# Altium schematic sheet 2.processor.SchDoc
size A3; Organization: Altium Limited; Address1: L3, 12a Rodborough Rd; Address2: Frenchs Forest; Address3: NSW; Address4: Australia 2086; SheetNumber: 2; SheetTotal: 4
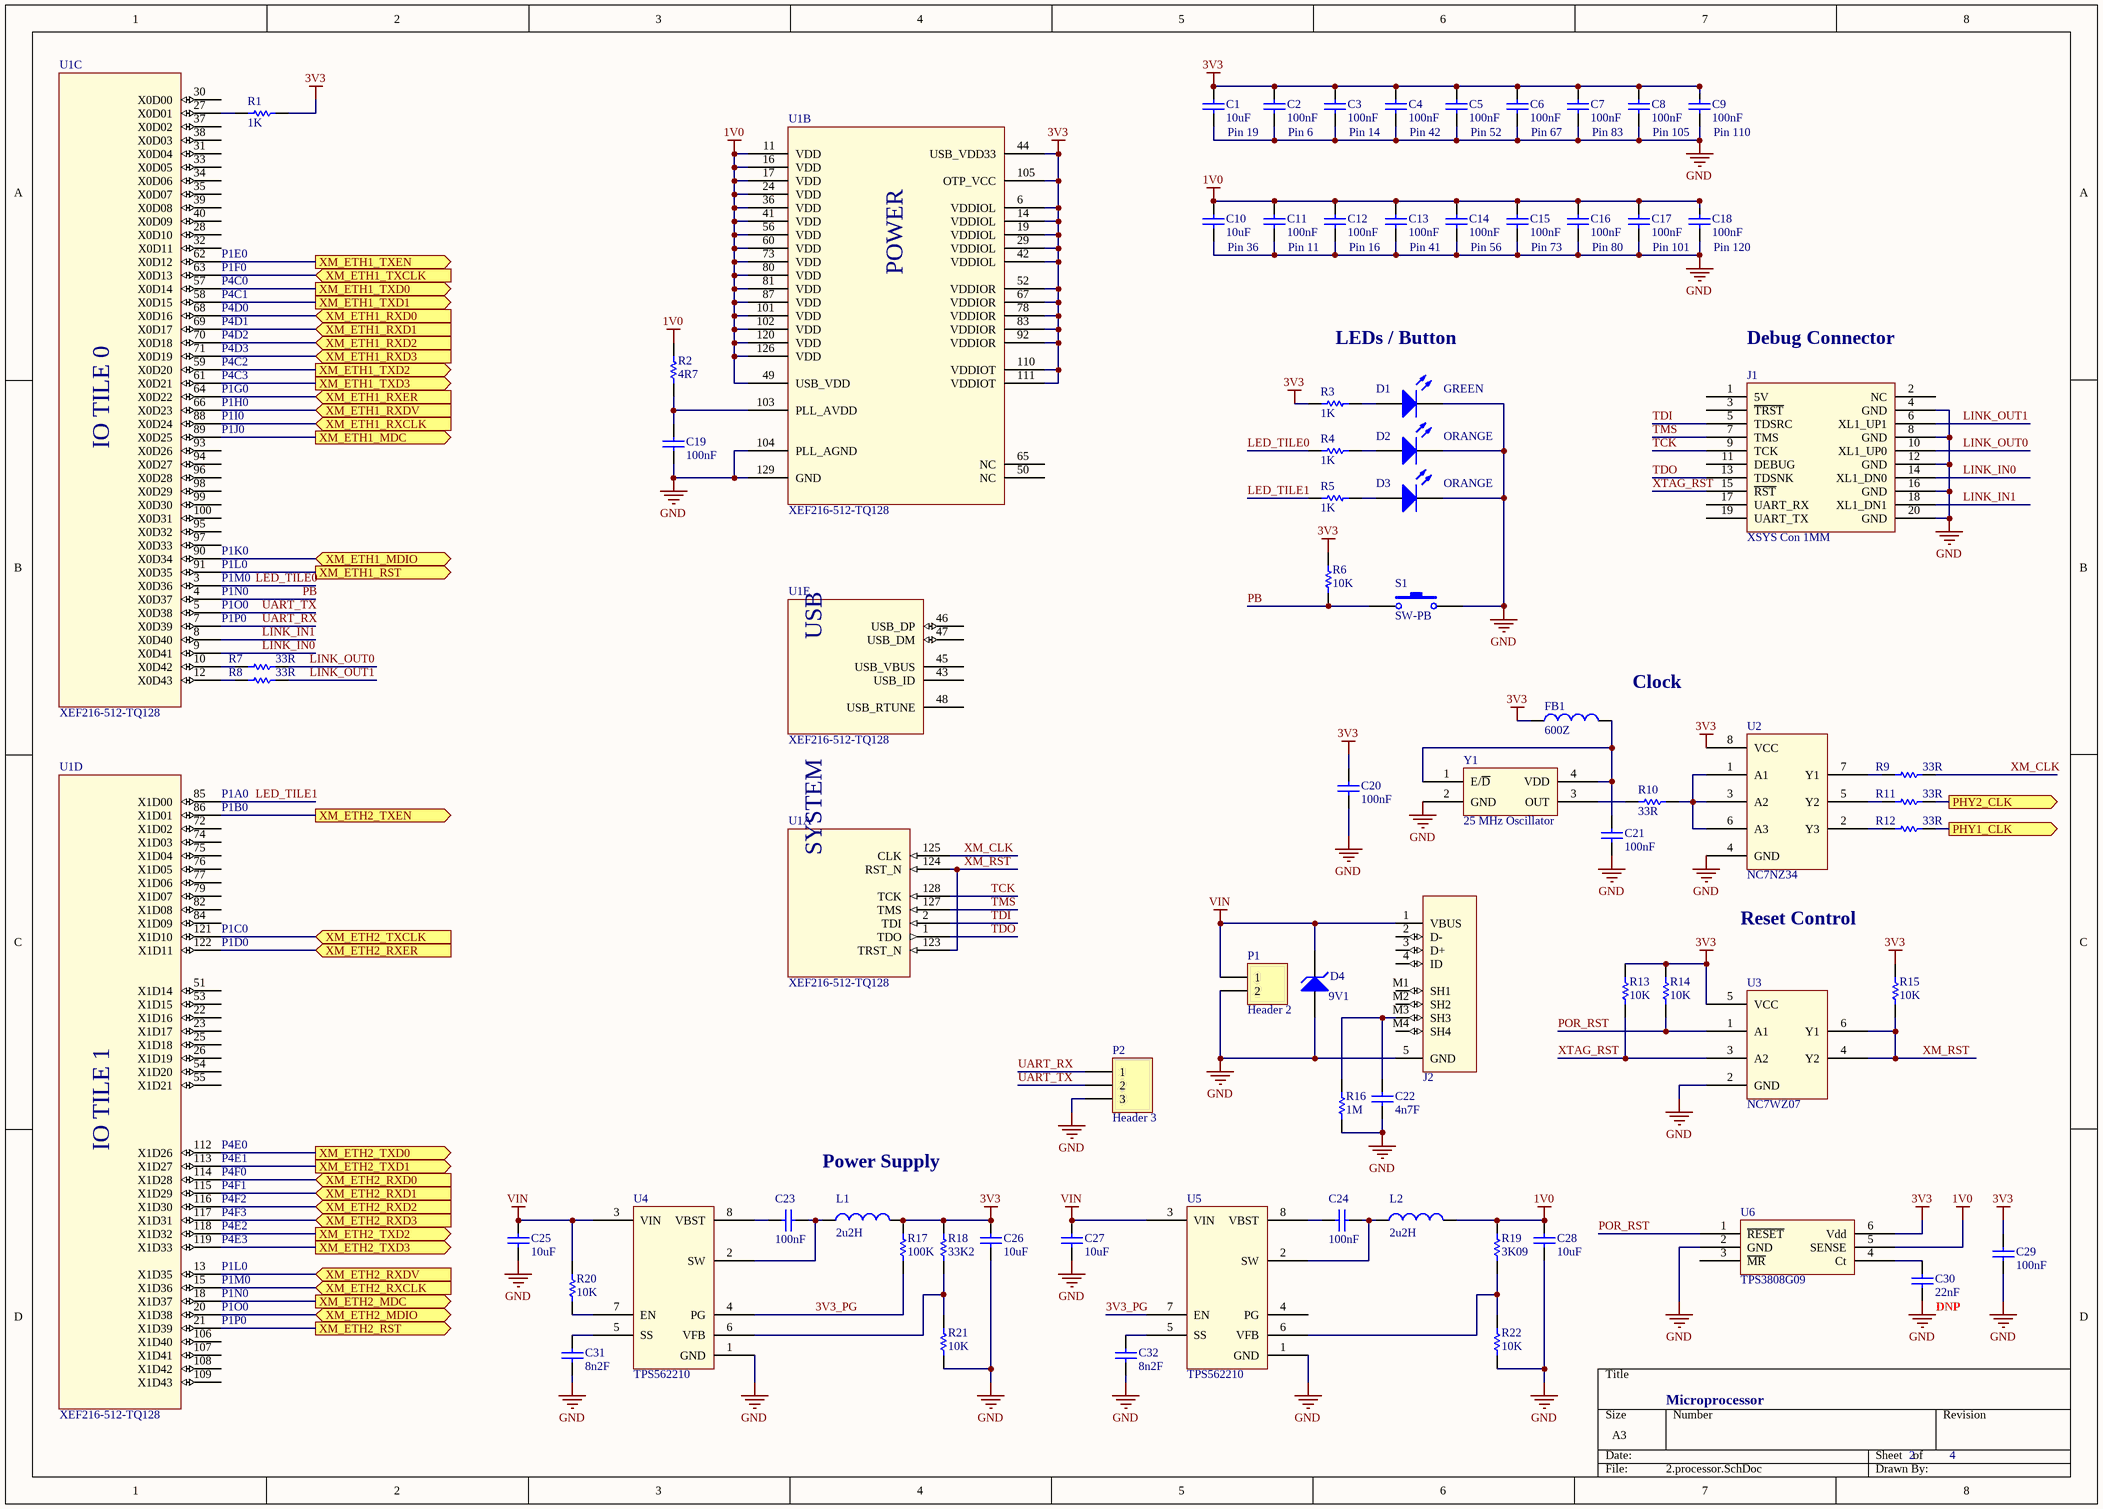
[diagram p0: 2.processor.SchDoc]

## Parts
C1  Pin 19  value 10uF  [1608[0603]_CAP2]
C2  Pin 6  value 100nF  [1005[0402]_CAP2]
C3  Pin 14  value 100nF  [1005[0402]_CAP2]
C4  Pin 42  value 100nF  [1005[0402]_CAP2]
C5  Pin 52  value 100nF  [1005[0402]_CAP2]
C6  Pin 67  value 100nF  [1005[0402]_CAP2]
C7  Pin 83  value 100nF  [1005[0402]_CAP2]
C8  Pin 105  value 100nF  [1005[0402]_CAP2]
C9  Pin 110  value 100nF  [1005[0402]_CAP2]
C10  Pin 36  value 10uF  [1608[0603]_CAP2]
C11  Pin 11  value 100nF  [1005[0402]_CAP2]
C12  Pin 16  value 100nF  [1005[0402]_CAP2]
C13  Pin 41  value 100nF  [1005[0402]_CAP2]
C14  Pin 56  value 100nF  [1005[0402]_CAP2]
C15  Pin 73  value 100nF  [1005[0402]_CAP2]
C16  Pin 80  value 100nF  [1005[0402]_CAP2]
C17  Pin 101  value 100nF  [1005[0402]_CAP2]
C18  Pin 120  value 100nF  [1005[0402]_CAP2]
C19  value 100nF  [1005[0402]_CAP2]  (hidden comment: Cap)
C20  value 100nF  [1005[0402]_CAP2]  (hidden comment: Cap)
C21  value 100nF  [1005[0402]_CAP2]  (hidden comment: Cap)
C22  value 4n7F  [1005[0402]_CAP2]  (hidden comment: Cap)
C23  value 100nF  [1005[0402]_CAP2]  (hidden comment: Cap)
C24  value 100nF  [1005[0402]_CAP2]  (hidden comment: Cap)
C25  value 10uF  [1608[0603]_CAP2]  (hidden comment: Cap)
C26  value 10uF  [1608[0603]_CAP2]  (hidden comment: Cap)
C27  value 10uF  [1608[0603]_CAP2]  (hidden comment: Cap)
C28  value 10uF  [1608[0603]_CAP2]  (hidden comment: Cap)
C29  value 100nF  [1005[0402]_CAP2]  (hidden comment: Cap)
C30  value 22nF  [1005[0402]_CAP2]  (hidden comment: Cap)
C31  value 8n2F  [1005[0402]_CAP2]  (hidden comment: Cap)
C32  value 8n2F  [1005[0402]_CAP2]  (hidden comment: Cap)
D1  value GREEN  [1608[0603]_LED]  (hidden comment: LED3)
D2  value ORANGE  [1608[0603]_LED]  (hidden comment: LED3)
D3  value ORANGE  [1608[0603]_LED]  (hidden comment: LED3)
D4  value 9V1  [SOD123F]  (hidden comment: Zener Diode)
FB1  value 600Z  [1005[0402]_FB2]  (hidden comment: Ferrite Bead)
J1  XSYS Con 1MM  [M40-3201045R]
J2  Micro-USB B Receptacle  [MOLEX_105017-0001]  (value not drawn)
L1  value 2u2H  [2012[0805]_IND]  (hidden comment: Inductor)
L2  value 2u2H  [2012[0805]_IND]  (hidden comment: Inductor)
P1  Header 2  [HDR1X2]
P2  Header 3  [HDR1X3]
R1  value 1K  [1005[0402]_RES2]  (hidden comment: Res)
R2  value 4R7  [1005[0402]_RES2]  (hidden comment: Res)
R3  value 1K  [1005[0402]_RES2]  (hidden comment: Res)
R4  value 1K  [1005[0402]_RES2]  (hidden comment: Res)
R5  value 1K  [1005[0402]_RES2]  (hidden comment: Res)
R6  value 10K  [1005[0402]_RES2]  (hidden comment: Res)
R7  value 33R  [1005[0402]_RES2]  (hidden comment: Res)
R8  value 33R  [1005[0402]_RES2]  (hidden comment: Res)
R9  value 33R  [1005[0402]_RES2]  (hidden comment: Res)
R10  value 33R  [1005[0402]_RES2]  (hidden comment: Res)
R11  value 33R  [1005[0402]_RES2]  (hidden comment: Res)
R12  value 33R  [1005[0402]_RES2]  (hidden comment: Res)
R13  value 10K  [1005[0402]_RES2]  (hidden comment: Res)
R14  value 10K  [1005[0402]_RES2]  (hidden comment: Res)
R15  value 10K  [1005[0402]_RES2]  (hidden comment: Res)
R16  value 1M  [1005[0402]_RES2]  (hidden comment: Res)
R17  value 100K  [1005[0402]_RES2]  (hidden comment: Res)
R18  value 33K2  [1005[0402]_RES2]  (hidden comment: Res)
R19  value 3K09  [1005[0402]_RES2]  (hidden comment: Res)
R20  value 10K  [1005[0402]_RES2]  (hidden comment: Res)
R21  value 10K  [1005[0402]_RES2]  (hidden comment: Res)
R22  value 10K  [1005[0402]_RES2]  (hidden comment: Res)
S1  SW-PB  [TACTILE_SW_6035_1]
U1  XEF216-512-TQ128  [XMOS_LQFP_128_XEF216_512]  (parts A,B,C,D,E of 5)
U2  NC7NZ34  [US8]
U3  NC7WZ07  [SOT363-6M_SC70]
U4  TPS562210  [SOT-23-8]
U5  TPS562210  [SOT-23-8]
U6  TPS3808G09  [SOT23-6]
Y1  25 MHz Oscillator  [OSC_32_25]

## Ports
PHY1_CLK (out), PHY2_CLK (out), XM_ETH1_MDC (out), XM_ETH1_MDIO (bidir), XM_ETH1_RST (out), XM_ETH1_RXCLK (in), XM_ETH1_RXD0 (in), XM_ETH1_RXD1 (in), XM_ETH1_RXD2 (in), XM_ETH1_RXD3 (in), XM_ETH1_RXDV (in), XM_ETH1_RXER (in), XM_ETH1_TXCLK (in), XM_ETH1_TXD0 (out), XM_ETH1_TXD1 (out), XM_ETH1_TXD2 (out), XM_ETH1_TXD3 (out), XM_ETH1_TXEN (out), XM_ETH2_MDC (out), XM_ETH2_MDIO (bidir), XM_ETH2_RST (out), XM_ETH2_RXCLK (in), XM_ETH2_RXD0 (in), XM_ETH2_RXD1 (in), XM_ETH2_RXD2 (in), XM_ETH2_RXD3 (in), XM_ETH2_RXDV (in), XM_ETH2_RXER (in), XM_ETH2_TXCLK (in), XM_ETH2_TXD0 (out), XM_ETH2_TXD1 (out), XM_ETH2_TXD2 (out), XM_ETH2_TXD3 (out), XM_ETH2_TXEN (out)

## Nets
1V0: C10.2 C11.2 C12.2 C13.2 C14.2 C15.2 C16.2 C17.2 C18.2 C28.2 L2.2 R2.2 R19.2 U1.11(VDD) U1.16(VDD) U1.17(VDD) U1.24(VDD) U1.36(VDD) U1.41(VDD) U1.49(USB_VDD) U1.56(VDD) U1.60(VDD) U1.73(VDD) U1.80(VDD) U1.81(VDD) U1.87(VDD) U1.101(VDD) U1.102(VDD) U1.120(VDD) U1.126(VDD) U6.5(SENSE)
3V3: C1.2 C2.2 C3.2 C4.2 C5.2 C6.2 C7.2 C8.2 C9.2 C20.2 C26.2 C29.2 FB1.1 L1.2 R1.2 R3.2 R6.2 R13.2 R14.2 R15.2 R17.2 R18.2 U1.6(VDDIOL) U1.14(VDDIOL) U1.19(VDDIOL) U1.29(VDDIOL) U1.42(VDDIOL) U1.44(USB_VDD33) U1.52(VDDIOR) U1.67(VDDIOR) U1.78(VDDIOR) U1.83(VDDIOR) U1.92(VDDIOR) U1.105(OTP_VCC) U1.110(VDDIOT) U1.111(VDDIOT) U2.8(VCC) U3.5(VCC) U6.6(Vdd)
GND: C1.1 C2.1 C3.1 C4.1 C5.1 C6.1 C7.1 C8.1 C9.1 C10.1 C11.1 C12.1 C13.1 C14.1 C15.1 C16.1 C17.1 C18.1 C19.1 C20.1 C21.1 C22.1 C25.1 C26.1 C27.1 C28.1 C29.1 C30.1 C31.1 C32.1 D1.2(K) D2.2(K) D3.2(K) D4.1(A) J1.4(GND) J1.8(GND) J1.12(GND) J1.16(GND) J1.20(GND) J2.5(GND) P1.2 P2.3 R16.1 R21.1 R22.1 S1.2 U1.104(PLL_AGND) U1.129(GND) U2.4(GND) U3.2(GND) U4.1(GND) U5.1(GND) U6.2(GND) Y1.2(GND)
VIN: C25.2 C27.2 D4.2(K) J2.1(VBUS) P1.1 R20.2 U4.3(VIN) U5.3(VIN)
3V3_PG: R17.1 U4.4(PG) U5.7(EN)
LED_TILE0: R4.2 U1.3(X0D36)
LED_TILE1: R5.2 U1.85(X1D00)
LINK_IN0: J1.14(XL1_DN0) U1.9(X0D41)
LINK_IN1: J1.18(XL1_DN1) U1.8(X0D40)
LINK_OUT0: J1.10(XL1_UP0) R7.1
LINK_OUT1: J1.6(XL1_UP1) R8.1
PB: R6.1 S1.1 U1.4(X0D37)
PHY1_CLK: R12.1 ; port PHY1_CLK
PHY2_CLK: R11.1 ; port PHY2_CLK
POR_RST: R14.1 U3.1(A1) U6.1(~{RESET})
TCK: J1.9(TCK) U1.128(TCK)
TDI: J1.5(TDSRC) U1.2(TDI)
TDO: J1.13(TDSNK) U1.1(TDO)
TMS: J1.7(TMS) U1.127(TMS)
UART_RX: P2.1 U1.7(X0D39)
UART_TX: P2.2 U1.5(X0D38)
XM_CLK: R9.1 U1.125(CLK)
XM_ETH1_MDC: U1.89(X0D25) ; port XM_ETH1_MDC
XM_ETH1_MDIO: U1.90(X0D34) ; port XM_ETH1_MDIO
XM_ETH1_RST: U1.91(X0D35) ; port XM_ETH1_RST
XM_ETH1_RXCLK: U1.88(X0D24) ; port XM_ETH1_RXCLK
XM_ETH1_RXD0: U1.68(X0D16) ; port XM_ETH1_RXD0
XM_ETH1_RXD1: U1.69(X0D17) ; port XM_ETH1_RXD1
XM_ETH1_RXD2: U1.70(X0D18) ; port XM_ETH1_RXD2
XM_ETH1_RXD3: U1.71(X0D19) ; port XM_ETH1_RXD3
XM_ETH1_RXDV: U1.66(X0D23) ; port XM_ETH1_RXDV
XM_ETH1_RXER: U1.64(X0D22) ; port XM_ETH1_RXER
XM_ETH1_TXCLK: U1.63(X0D13) ; port XM_ETH1_TXCLK
XM_ETH1_TXD0: U1.57(X0D14) ; port XM_ETH1_TXD0
XM_ETH1_TXD1: U1.58(X0D15) ; port XM_ETH1_TXD1
XM_ETH1_TXD2: U1.59(X0D20) ; port XM_ETH1_TXD2
XM_ETH1_TXD3: U1.61(X0D21) ; port XM_ETH1_TXD3
XM_ETH1_TXEN: U1.62(X0D12) ; port XM_ETH1_TXEN
XM_ETH2_MDC: U1.18(X1D37) ; port XM_ETH2_MDC
XM_ETH2_MDIO: U1.20(X1D38) ; port XM_ETH2_MDIO
XM_ETH2_RST: U1.21(X1D39) ; port XM_ETH2_RST
XM_ETH2_RXCLK: U1.15(X1D36) ; port XM_ETH2_RXCLK
XM_ETH2_RXD0: U1.114(X1D28) ; port XM_ETH2_RXD0
XM_ETH2_RXD1: U1.115(X1D29) ; port XM_ETH2_RXD1
XM_ETH2_RXD2: U1.116(X1D30) ; port XM_ETH2_RXD2
XM_ETH2_RXD3: U1.117(X1D31) ; port XM_ETH2_RXD3
XM_ETH2_RXDV: U1.13(X1D35) ; port XM_ETH2_RXDV
XM_ETH2_RXER: U1.122(X1D11) ; port XM_ETH2_RXER
XM_ETH2_TXCLK: U1.121(X1D10) ; port XM_ETH2_TXCLK
XM_ETH2_TXD0: U1.112(X1D26) ; port XM_ETH2_TXD0
XM_ETH2_TXD1: U1.113(X1D27) ; port XM_ETH2_TXD1
XM_ETH2_TXD2: U1.118(X1D32) ; port XM_ETH2_TXD2
XM_ETH2_TXD3: U1.119(X1D33) ; port XM_ETH2_TXD3
XM_ETH2_TXEN: U1.86(X1D01) ; port XM_ETH2_TXEN
XM_RST: R15.1 U1.123(TRST_N) U1.124(RST_N) U3.4(Y2) U3.6(Y1)
XTAG_RST: J1.15(~{RST}) R13.1 U3.3(A2)
NetC19_2: C19.2 R2.1 U1.103(PLL_AVDD)
NetC21_2: C21.2 FB1.2 Y1.1(E/~{D}) Y1.4(VDD)
NetC22_2: C22.2 J2.M3(SH3) R16.2
NetC23_1: C23.1 U4.8(VBST)
NetC23_2: C23.2 L1.1 U4.2(SW)
NetC24_1: C24.1 U5.8(VBST)
NetC24_2: C24.2 L2.1 U5.2(SW)
NetC30_2: C30.2 U6.4(Ct)
NetC31_2: C31.2 U4.5(SS)
NetC32_2: C32.2 U5.5(SS)
NetD1_1: D1.1(A) R3.1
NetD2_1: D2.1(A) R4.1
NetD3_1: D3.1(A) R5.1
NetR1_1: R1.1 U1.27(X0D01)
NetR7_2: R7.2 U1.10(X0D42)
NetR8_2: R8.2 U1.12(X0D43)
NetR9_2: R9.2 U2.7(Y1)
NetR10_1: R10.1 U2.1(A1) U2.3(A2) U2.6(A3)
NetR10_2: R10.2 Y1.3(OUT)
NetR11_2: R11.2 U2.5(Y2)
NetR12_2: R12.2 U2.2(Y3)
NetR18_1: R18.1 R21.2 U4.6(VFB)
NetR19_1: R19.1 R22.2 U5.6(VFB)
NetR20_1: R20.1 U4.7(EN)

Not connected (* = marked no-connect by the designer): J1 1(5V) 2(NC) 3(~{TRST}) 11(DEBUG) 17(UART_RX) 19(UART_TX); J2 2(D-) 3(D+) 4(ID) M1(SH1) M2(SH2) M4(SH4); U1 22(X1D16) 23(X1D17) 25(X1D18) 26(X1D19) 28(X0D10) 30(X0D00) 31(X0D04) 32(X0D11) 33(X0D05) 34(X0D06) 35(X0D07) 37(X0D02) 38(X0D03) 39(X0D08) 40(X0D09) 43(USB_ID) 45(USB_VBUS) 46(USB_DP) 47(USB_DM) 48(USB_RTUNE) 50(NC) 51(X1D14) 53(X1D15) 54(X1D20) 55(X1D21) 65(NC) 72(X1D02) 74(X1D03) 75(X1D04) 76(X1D05) 77(X1D06) 79(X1D07) 82(X1D08) 84(X1D09) 93(X0D26) 94(X0D27) 95(X0D32) 96(X0D28) 97(X0D33) 98(X0D29) 99(X0D30) 100(X0D31) 106(X1D40) 107(X1D41) 108(X1D42) 109(X1D43); U5 4(PG); U6 3(~{MR})

## Notes on the sheet
- (near U1) P1E0
- (near U1) P1F0
- (near U1) P4C0
- (near U1) P4C1
- (near U1) P4D0
- (near U1) P4D1
- (near U1) P4D2
- (near U1) P4D3
- (near U1) P4C2
- (near U1) P4C3
- LEDs / Button
- (near J1) Debug Connector
- (near U1) P1G0
- (near U1) P1H0
- (near U1) P1I0
- (near U1) P1J0
- (near U1) P1K0
- (near U1) P1L0
- (near U1) P1M0
- (near U1) P1N0
- P1O0
- P1P0
- (near FB1) Clock
- (near U1) P1A0
- (near U1) P1B0
- (near U1) P1C0
- (near U1) P1D0
- Reset Control
- (near U1) P4E0
- (near U1) P4E1
- (near U1) P4F0
- (near U1) P4F1
- Power Supply
- (near U1) P4F2
- (near U1) P4F3
- (near U1) P4E2
- (near U1) P4E3
- (near U1) P1O0
- (near U1) P1P0
- (near C30) DNP
- Microprocessor
- Title
- Size:
- Date:
- A3
- Number:
- Time:
- Revision:
- Sheet
- of
- File:
- (in symbol XEF216-512-TQ128, part A) SYSTEM
- (in symbol XEF216-512-TQ128, part B) POWER
- (in symbol XEF216-512-TQ128, part C) IO TILE 0
- (in symbol XEF216-512-TQ128, part D) IO TILE 1
- (in symbol XEF216-512-TQ128, part E) USB

## Library data of the parts
C1 C10 C25-C28 = Cap: Capacitor; Manufacturer: SAMSUNG; Vendor: Digikey; VendorCode: 1276-6775-1-ND; ProductCode: CL10A106MPNNHBC; Published: 8-Jun-2000; LatestRevisionDate: 17-Jul-2002; LatestRevisionNote: Re-released for DXP Platform.; PackageReference: RAD-0.3; Publisher: Altium Limited; Price: 0,22
C2-C9 C11-C21 C23 C24 C29 = Cap: Capacitor; Manufacturer: SAMSUNG; ProductCode: CL05B104KO5NNNC; Vendor: Digikey; VendorCode: 1276-1001-1-ND; Published: 8-Jun-2000; LatestRevisionDate: 17-Jul-2002; LatestRevisionNote: Re-released for DXP Platform.; PackageReference: RAD-0.3; Publisher: Altium Limited; Price: 0,01
C22 = Cap: Capacitor; Manufacturer: SAMSUNG; Vendor: Digikey; ProductCode: CL05B472KB5NNNC; VendorCode: 1276-1125-1-ND; Published: 8-Jun-2000; LatestRevisionDate: 17-Jul-2002; LatestRevisionNote: Re-released for DXP Platform.; PackageReference: RAD-0.3; Publisher: Altium Limited; Price: 0,09
C30 = Cap: Capacitor; Manufacturer: SAMSUNG; ProductCode: CL05B223KP5NNNC; Vendor: Digikey; VendorCode: 1276-1538-1-ND; Published: 8-Jun-2000; LatestRevisionDate: 17-Jul-2002; LatestRevisionNote: Re-released for DXP Platform.; PackageReference: RAD-0.3; Publisher: Altium Limited; Price: 0,10
C31 C32 = Cap: Capacitor; Manufacturer: SAMSUNG; ProductCode: CL05B822KA5NNNC; VendorCode: 1276-1590-1-ND; Vendor: Digikey; Published: 8-Jun-2000; LatestRevisionDate: 17-Jul-2002; LatestRevisionNote: Re-released for DXP Platform.; PackageReference: RAD-0.3; Publisher: Altium Limited; Price: 0,09
D1 = LED3: SMD LED; Manufacturer: BROADCOM; ProductCode: HSMG-C190; Vendor: Digikey; VendorCode: 516-1425-1-ND; Published: 8-Jun-2000; LatestRevisionDate: 17-Dec-2003; LatestRevisionNote: PCB Footprint replaced.; DatasheetVersion: 16-Apr-2002; PackageVersion: 16-Apr-2002; PackageReference: 3.5X2.8X1.9; Publisher: Altium Limited; Price: 0,55
D2 D3 = LED3: SMD LED; Manufacturer: BROADCOM; ProductCode: HSMD-C191; Vendor: Digikey; VendorCode: 516-2826-1-ND; Published: 8-Jun-2000; LatestRevisionDate: 17-Dec-2003; LatestRevisionNote: PCB Footprint replaced.; DatasheetVersion: 16-Apr-2002; PackageVersion: 16-Apr-2002; PackageReference: 3.5X2.8X1.9; Publisher: Altium Limited; Price: 0,55
D4 = Diode Zener: Manufacturer: NEXPERIA; ProductCode: NZH9V1B; Vendor: Digikey; VendorCode: 1727-5081-1-ND; Price: 0,20
FB1 = Ferrite Bead: Manufacturer: MURATA; Code_IEC: 1005; ProductCode: BLM15AX601SN1D; Vendor: Digikey; VendorCode: 490-5441-1-ND; Published: 8-Jun-2000; LatestRevisionDate: 29-May-2009; LatestRevisionNote: IPC-7351 Footprint Added.; PackageReference: 0402-A; Publisher: Altium Limited; PackageDescription: Chip Inductor; Code_JEITA: 0402; Price: 0,11
J1 = XTAG2_CON: XTAG2 Connector; Manufacturer: HARWIN; Vendor: Digikey; VendorCode: 952-1672-1-ND; ProductCode: M40-3201045R; Price: 2,47
J2 = Molex Micro-USB 105017-1001: Micro-USB B Receptacle with Flange, Bottom Mount, SMT, Lead-Free; MP: 47346-0001; MF: Molex; Vendor: Digikey; VendorCode: WM11262CT-ND; Price: 1,43; Availability: Good; Package: None; Value: *; Manufacturer: MOLEX; ProductCode: 105017-1001
L1 L2 = Inductor: Manufacturer: WURTH; Code_IEC: 1005; ProductCode: 74479275222; Vendor: Digikey; VendorCode: 732-9708-1-ND; Published: 8-Jun-2000; LatestRevisionDate: 29-May-2009; LatestRevisionNote: IPC-7351 Footprint Added.; PackageReference: 0402-A; Publisher: Altium Limited; PackageDescription: Chip Inductor; Code_JEITA: 0402; Price: 1,28
P1 = Header 2: Header, 2-Pin; LatestRevisionDate: 17-Jul-2002; LatestRevisionNote: Re-released for DXP Platform.; Publisher: Altium Limited
P2 = Header 3: Header, 3-Pin; LatestRevisionDate: 17-Jul-2002; LatestRevisionNote: Re-released for DXP Platform.; Publisher: Altium Limited
R1 R3-R5 = Res: Resistor; Manufacturer: PANASONIC; ProductCode: ERJ-2GEJ102X; Vendor: Digikey; VendorCode: P1.0KJCT-ND; Published: 8-Jun-2000; LatestRevisionDate: 17-Jul-2002; LatestRevisionNote: Re-released for DXP Platform.; PackageReference: AXIAL-0.3; Publisher: Altium Limited; Price: 0,09
R2 = Res: Resistor; Manufacturer: PANASONIC; ProductCode: ERJ-2GEJ4R7X; Vendor: Digikey; VendorCode: P4.7JCT-ND; Published: 8-Jun-2000; LatestRevisionDate: 17-Jul-2002; LatestRevisionNote: Re-released for DXP Platform.; PackageReference: AXIAL-0.3; Publisher: Altium Limited; Price: 0,09
R6 R14 R15 R20 = Res: Resistor; Manufacturer: PANASONIC; VendorCode: P15984CT-ND; ProductCode: ERJ-2RHD1002X; Vendor: Digikey; Vendor: Digikeu; Published: 8-Jun-2000; LatestRevisionDate: 17-Jul-2002; LatestRevisionNote: Re-released for DXP Platform.; PackageReference: AXIAL-0.3; Publisher: Altium Limited; Price: 0,10
R7-R12 = Res: Resistor; Manufacturer: PANASONIC; Vendor: Digikey; VendorCode: P33JCT-ND; ProductCode: ERJ-2GEJ330X; Published: 8-Jun-2000; LatestRevisionDate: 17-Jul-2002; LatestRevisionNote: Re-released for DXP Platform.; PackageReference: AXIAL-0.3; Publisher: Altium Limited; Price: 0,02
R13 = Res: Resistor; Manufacturer: PANASONIC; VendorCode: P15984CT-ND; ProductCode: ERJ-2RHD1002X; Vendor: Digikey; Published: 8-Jun-2000; LatestRevisionDate: 17-Jul-2002; LatestRevisionNote: Re-released for DXP Platform.; PackageReference: AXIAL-0.3; Publisher: Altium Limited; Price: 0,10
R16 = Res: Resistor; Manufacturer: PANASONIC; Vendor: Digikey; ProductCode: ERJ-2RKF1004X; VendorCode: P1.00MLCT-ND; Published: 8-Jun-2000; LatestRevisionDate: 17-Jul-2002; LatestRevisionNote: Re-released for DXP Platform.; PackageReference: AXIAL-0.3; Publisher: Altium Limited; Price: 0,09
R17 = Res: Resistor; Manufacturer: PANASONIC; ProductCode: ERJ-2RKF1003X; VendorCode: P100KLCT-ND; Vendor: Digikey; Published: 8-Jun-2000; LatestRevisionDate: 17-Jul-2002; LatestRevisionNote: Re-released for DXP Platform.; PackageReference: AXIAL-0.3; Publisher: Altium Limited; Price: 0,09
R18 = Res: Resistor; Manufacturer: PANASONIC; ProductCode: ERA-2AEB3322X; Vendor: Digikey; VendorCode: P33.2KDCCT-ND; Published: 8-Jun-2000; LatestRevisionDate: 17-Jul-2002; LatestRevisionNote: Re-released for DXP Platform.; PackageReference: AXIAL-0.3; Publisher: Altium Limited; Price: 0,40
R19 = Res: Resistor; Manufacturer: PANASONIC; ProductCode: ERA-2AEB3091X; Vendor: Digikey; VendorCode: P3.09KDCCT-ND; Published: 8-Jun-2000; LatestRevisionDate: 17-Jul-2002; LatestRevisionNote: Re-released for DXP Platform.; PackageReference: AXIAL-0.3; Publisher: Altium Limited; Price: 0,40
R21 R22 = Res: Resistor; Manufacturer: PANASONIC; ProductCode: ERJ-2RHD1002X; Vendor: Digikey; VendorCode: P15984CT-ND; Published: 8-Jun-2000; LatestRevisionDate: 17-Jul-2002; LatestRevisionNote: Re-released for DXP Platform.; PackageReference: AXIAL-0.3; Publisher: Altium Limited; Price: 0,10
S1 = SW-PB: Switch; Manufacturer: PANASONIC; ProductCode: EVQ-5PN05K; VendorCode: P13596SCT-ND; Vendor: Digikey; Published: 24-Mar-1999; LatestRevisionDate: 17-Jul-2002; LatestRevisionNote: Re-released for DXP Platform.; PackageReference: SPST-2; Publisher: Altium Limited; Price: 0,54
U1 = XEF216-512-TQ128: XMOS xCORE200 Processor; Manufacturer Part Number: XE216-512-TQ128; XMOS Part Number: JG-NEW-0002; ProductCode: XEF216-512-TQ128-C20; Vendor: Digikey; VendorCode: 880-1100-ND; Manufacturer: XMOS; Price: 18,00
U2 = NC7NZ34: Tripple Buffer; Manufacturer: ON SEMICONDUCTOR; ProductCode: NC7NZ34K8X; Vendor: Digikey; VendorCode: NC7NZ34K8XCT-ND; Price: 0,45
U3 = NC7WZ07: Dual Buffer (open drain output); Manufacturer: ON SEMICONDUCTOR; Vendor: Digikey; ProductCode: NC7WZ07P6X; VendorCode: NC7WZ07P6XCT-ND; PricePerPiece: 0,36; Price: 0,36
U4 U5 = TPS562210: Buck converter; Manufacturer: TEXAS INSTRUMENTS; ProductCode: TPS562210DDFT; VendorCode: 296-41139-1-ND; Vendor: Digikey; Price: 1,48
U6 = TPS3808G09: Power on Reset controller 0.9V; Manufacturer: TEXAS INSTRUMENTS; ProductCode: TPS3808G09DBVR; VendorCode: 296-17189-1-ND; Vendor: Digikey; Price: 1,74
Y1 = oscillator: Crystal Oscillator; Manufacturer: ABRACON; ProductCode: ASTMLPE-25.000MHZ-EJ-E-T; VendorCode: 535-13121-1-ND; Vendor: Digikey; Price: 1,50